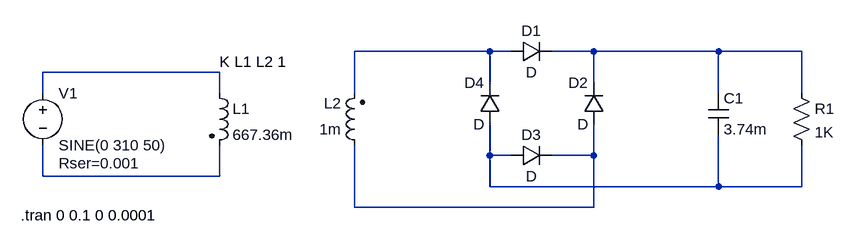
[diagram p0: schematic 1.asc]
1.asc, the LTspice schematic file:
Version 4
SHEET 1 1160 680
WIRE 624 48 416 48
WIRE 656 48 624 48
WIRE 784 48 720 48
WIRE 976 48 784 48
WIRE 1104 48 976 48
WIRE 208 80 -64 80
WIRE 624 96 624 48
WIRE 784 96 784 48
WIRE -64 112 -64 80
WIRE 208 112 208 80
WIRE 416 112 416 48
WIRE 976 112 976 48
WIRE 1104 112 1104 48
WIRE 624 208 624 160
WIRE 656 208 624 208
WIRE 784 208 784 160
WIRE 784 208 720 208
WIRE -64 240 -64 192
WIRE 208 240 208 192
WIRE 208 240 -64 240
WIRE 624 256 624 208
WIRE 976 256 976 176
WIRE 976 256 624 256
WIRE 1104 256 1104 192
WIRE 1104 256 976 256
WIRE 416 288 416 192
WIRE 784 288 784 208
WIRE 784 288 416 288
SYMBOL voltage -64 96 R0
WINDOW 123 0 0 Left 2
WINDOW 39 24 124 Left 2
SYMATTR InstName V1
SYMATTR Value SINE(0 310 50)
SYMATTR SpiceLine Rser=0.001
SYMBOL ind2 192 96 R0
SYMATTR InstName L1
SYMATTR Value 667.36m
SYMATTR Type ind
SYMBOL diode 656 64 R270
WINDOW 0 32 32 VTop 2
WINDOW 3 0 32 VBottom 2
SYMATTR InstName D1
SYMBOL diode 800 160 R180
WINDOW 0 24 64 Left 2
WINDOW 3 24 0 Left 2
SYMATTR InstName D2
SYMBOL diode 640 160 R180
WINDOW 0 24 64 Left 2
WINDOW 3 24 0 Left 2
SYMATTR InstName D4
SYMBOL diode 656 224 R270
WINDOW 0 32 32 VTop 2
WINDOW 3 0 32 VBottom 2
SYMATTR InstName D3
SYMBOL cap 960 112 R0
SYMATTR InstName C1
SYMATTR Value 3.74m
SYMBOL res 1088 96 R0
SYMATTR InstName R1
SYMATTR Value 1K
SYMBOL ind2 432 208 R180
WINDOW 0 36 80 Left 2
WINDOW 3 36 40 Left 2
SYMATTR InstName L2
SYMATTR Value 1m
SYMATTR Type ind
TEXT 208 64 Left 2 !K L1 L2 1
TEXT -98 300 Left 2 !.tran 0 0.1 0 0.0001

The netlist it stands for:
* 1.asc
V1 N003 N006 SINE(0 310 50) Rser=0.001
L1 N003 N006 667.36m
D1 N001 N002 D
D2 N005 N002 D
D4 N004 N001 D
D3 N004 N005 D
C1 N002 N004 3.74m
R1 N002 N004 1K
L2 N005 N001 1m
.model D D
.lib standard.dio
K L1 L2 1
.tran 0 0.1 0 0.0001
.backanno
.end